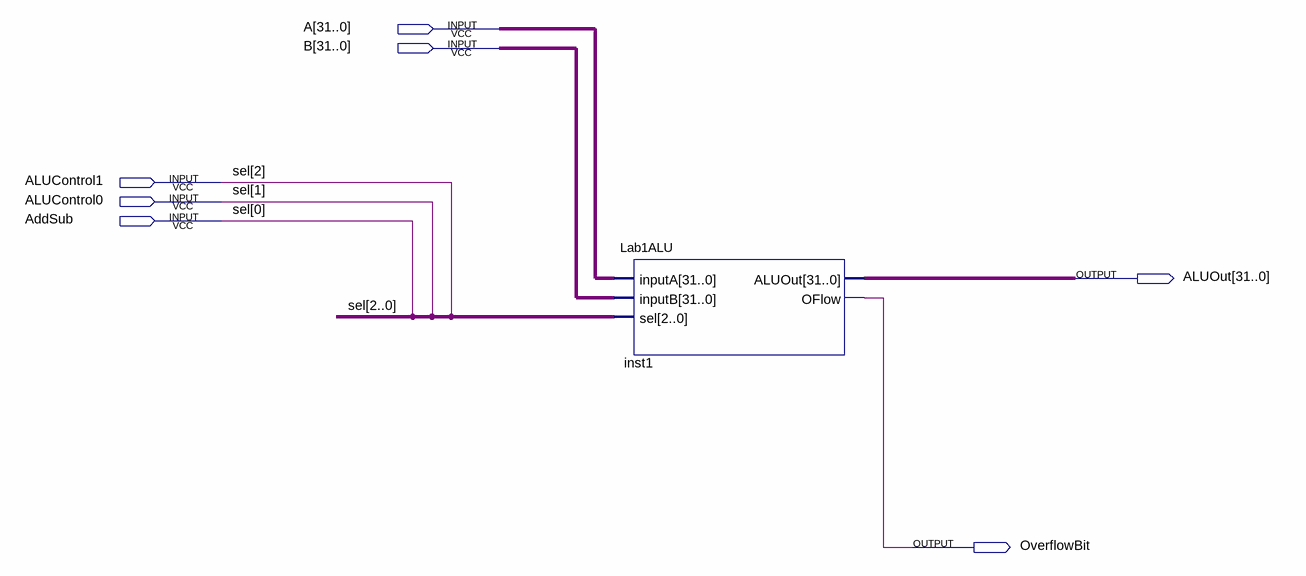
[diagram p0: schematic sheet]
// Quartus schematic FunctionalALU.bdf as structural Verilog: 1 symbols, 7 pins
module FunctionalALU (
  input  [31:0] A,
  input  [31:0] B,
  input  ALUControl1,
  input  ALUControl0,
  input  AddSub,
  output [31:0] ALUOut,
  output OverflowBit
);

  Lab1ALU inst1 (
    .inputA(A), .inputB(B), .sel({ALUControl1, ALUControl0, AddSub}), .ALUOut(ALUOut), .OFlow(OverflowBit));

  // Other names for the same wires on the sheet: sel[2:0] = {ALUControl1, ALUControl0, AddSub}
endmodule
